# Altium schematic sheet FIT_FPGA_A-B-C.SchDoc
size A4; SheetNumber: 25; SheetTotal: 29
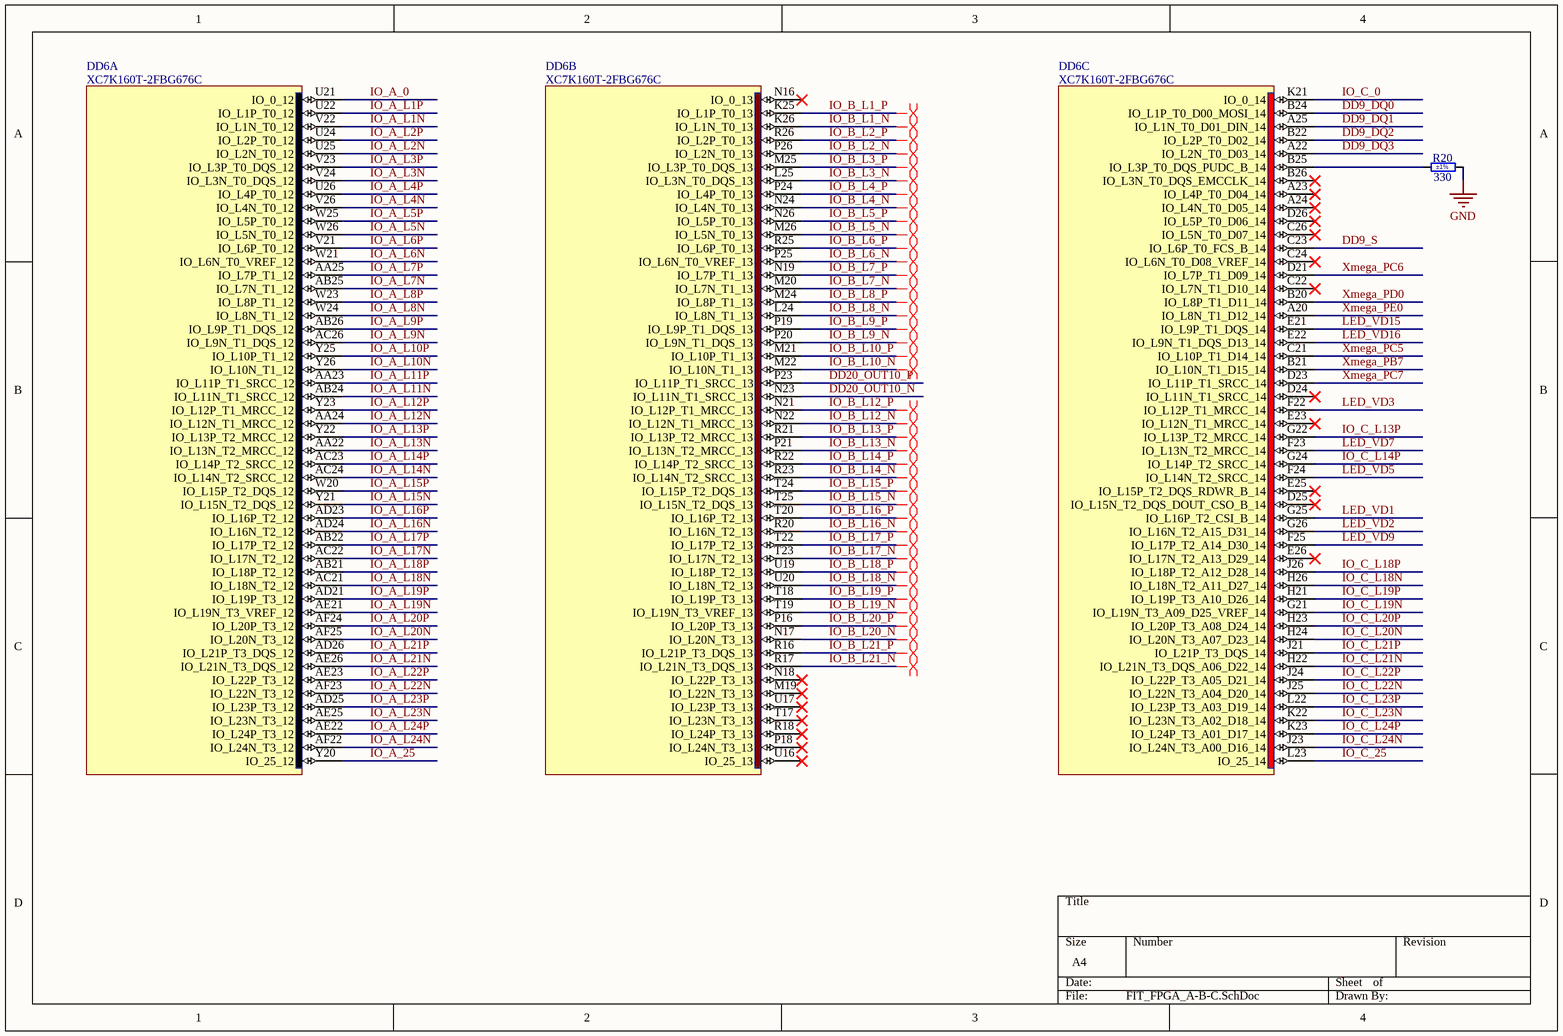
[diagram p0: FIT_FPGA_A-B-C.SchDoc]

## Parts
DD6  XC7K160T-2FBG676C  [BGA676C100P26X26_2700X2700X254]  (parts A,B,C of 15)
R20  330  Tolerance: ±1%  [RESC2012X60N]

## Nets
GND: R20.2
DD9_DQ0: DD6.B24(IO_L1P_T0_D00_MOSI_14)
DD9_DQ1: DD6.A25(IO_L1N_T0_D01_DIN_14)
DD9_DQ2: DD6.B22(IO_L2P_T0_D02_14)
DD9_DQ3: DD6.A22(IO_L2N_T0_D03_14)
DD9_S: DD6.C23(IO_L6P_T0_FCS_B_14)
DD20_OUT10_N: DD6.N23(IO_L11N_T1_SRCC_13)
DD20_OUT10_P: DD6.P23(IO_L11P_T1_SRCC_13)
IO_A_0: DD6.U21(IO_0_12)
IO_A_25: DD6.Y20(IO_25_12)
IO_A_L1N: DD6.V22(IO_L1N_T0_12)
IO_A_L1P: DD6.U22(IO_L1P_T0_12)
IO_A_L2N: DD6.U25(IO_L2N_T0_12)
IO_A_L2P: DD6.U24(IO_L2P_T0_12)
IO_A_L3N: DD6.V24(IO_L3N_T0_DQS_12)
IO_A_L3P: DD6.V23(IO_L3P_T0_DQS_12)
IO_A_L4N: DD6.V26(IO_L4N_T0_12)
IO_A_L4P: DD6.U26(IO_L4P_T0_12)
IO_A_L5N: DD6.W26(IO_L5N_T0_12)
IO_A_L5P: DD6.W25(IO_L5P_T0_12)
IO_A_L6N: DD6.W21(IO_L6N_T0_VREF_12)
IO_A_L6P: DD6.V21(IO_L6P_T0_12)
IO_A_L7N: DD6.AB25(IO_L7N_T1_12)
IO_A_L7P: DD6.AA25(IO_L7P_T1_12)
IO_A_L8N: DD6.W24(IO_L8N_T1_12)
IO_A_L8P: DD6.W23(IO_L8P_T1_12)
IO_A_L9N: DD6.AC26(IO_L9N_T1_DQS_12)
IO_A_L9P: DD6.AB26(IO_L9P_T1_DQS_12)
IO_A_L10N: DD6.Y26(IO_L10N_T1_12)
IO_A_L10P: DD6.Y25(IO_L10P_T1_12)
IO_A_L11N: DD6.AB24(IO_L11N_T1_SRCC_12)
IO_A_L11P: DD6.AA23(IO_L11P_T1_SRCC_12)
IO_A_L12N: DD6.AA24(IO_L12N_T1_MRCC_12)
IO_A_L12P: DD6.Y23(IO_L12P_T1_MRCC_12)
IO_A_L13N: DD6.AA22(IO_L13N_T2_MRCC_12)
IO_A_L13P: DD6.Y22(IO_L13P_T2_MRCC_12)
IO_A_L14N: DD6.AC24(IO_L14N_T2_SRCC_12)
IO_A_L14P: DD6.AC23(IO_L14P_T2_SRCC_12)
IO_A_L15N: DD6.Y21(IO_L15N_T2_DQS_12)
IO_A_L15P: DD6.W20(IO_L15P_T2_DQS_12)
IO_A_L16N: DD6.AD24(IO_L16N_T2_12)
IO_A_L16P: DD6.AD23(IO_L16P_T2_12)
IO_A_L17N: DD6.AC22(IO_L17N_T2_12)
IO_A_L17P: DD6.AB22(IO_L17P_T2_12)
IO_A_L18N: DD6.AC21(IO_L18N_T2_12)
IO_A_L18P: DD6.AB21(IO_L18P_T2_12)
IO_A_L19N: DD6.AE21(IO_L19N_T3_VREF_12)
IO_A_L19P: DD6.AD21(IO_L19P_T3_12)
IO_A_L20N: DD6.AF25(IO_L20N_T3_12)
IO_A_L20P: DD6.AF24(IO_L20P_T3_12)
IO_A_L21N: DD6.AE26(IO_L21N_T3_DQS_12)
IO_A_L21P: DD6.AD26(IO_L21P_T3_DQS_12)
IO_A_L22N: DD6.AF23(IO_L22N_T3_12)
IO_A_L22P: DD6.AE23(IO_L22P_T3_12)
IO_A_L23N: DD6.AE25(IO_L23N_T3_12)
IO_A_L23P: DD6.AD25(IO_L23P_T3_12)
IO_A_L24N: DD6.AF22(IO_L24N_T3_12)
IO_A_L24P: DD6.AE22(IO_L24P_T3_12)
IO_B_L1_N: DD6.K26(IO_L1N_T0_13)
IO_B_L1_P: DD6.K25(IO_L1P_T0_13)
IO_B_L2_N: DD6.P26(IO_L2N_T0_13)
IO_B_L2_P: DD6.R26(IO_L2P_T0_13)
IO_B_L3_N: DD6.L25(IO_L3N_T0_DQS_13)
IO_B_L3_P: DD6.M25(IO_L3P_T0_DQS_13)
IO_B_L4_N: DD6.N24(IO_L4N_T0_13)
IO_B_L4_P: DD6.P24(IO_L4P_T0_13)
IO_B_L5_N: DD6.M26(IO_L5N_T0_13)
IO_B_L5_P: DD6.N26(IO_L5P_T0_13)
IO_B_L6_N: DD6.P25(IO_L6N_T0_VREF_13)
IO_B_L6_P: DD6.R25(IO_L6P_T0_13)
IO_B_L7_N: DD6.M20(IO_L7N_T1_13)
IO_B_L7_P: DD6.N19(IO_L7P_T1_13)
IO_B_L8_N: DD6.L24(IO_L8N_T1_13)
IO_B_L8_P: DD6.M24(IO_L8P_T1_13)
IO_B_L9_N: DD6.P20(IO_L9N_T1_DQS_13)
IO_B_L9_P: DD6.P19(IO_L9P_T1_DQS_13)
IO_B_L10_N: DD6.M22(IO_L10N_T1_13)
IO_B_L10_P: DD6.M21(IO_L10P_T1_13)
IO_B_L12_N: DD6.N22(IO_L12N_T1_MRCC_13)
IO_B_L12_P: DD6.N21(IO_L12P_T1_MRCC_13)
IO_B_L13_N: DD6.P21(IO_L13N_T2_MRCC_13)
IO_B_L13_P: DD6.R21(IO_L13P_T2_MRCC_13)
IO_B_L14_N: DD6.R23(IO_L14N_T2_SRCC_13)
IO_B_L14_P: DD6.R22(IO_L14P_T2_SRCC_13)
IO_B_L15_N: DD6.T25(IO_L15N_T2_DQS_13)
IO_B_L15_P: DD6.T24(IO_L15P_T2_DQS_13)
IO_B_L16_N: DD6.R20(IO_L16N_T2_13)
IO_B_L16_P: DD6.T20(IO_L16P_T2_13)
IO_B_L17_N: DD6.T23(IO_L17N_T2_13)
IO_B_L17_P: DD6.T22(IO_L17P_T2_13)
IO_B_L18_N: DD6.U20(IO_L18N_T2_13)
IO_B_L18_P: DD6.U19(IO_L18P_T2_13)
IO_B_L19_N: DD6.T19(IO_L19N_T3_VREF_13)
IO_B_L19_P: DD6.T18(IO_L19P_T3_13)
IO_B_L20_N: DD6.N17(IO_L20N_T3_13)
IO_B_L20_P: DD6.P16(IO_L20P_T3_13)
IO_B_L21_N: DD6.R17(IO_L21N_T3_DQS_13)
IO_B_L21_P: DD6.R16(IO_L21P_T3_DQS_13)
IO_C_0: DD6.K21(IO_0_14)
IO_C_25: DD6.L23(IO_25_14)
IO_C_L13P: DD6.G22(IO_L13P_T2_MRCC_14)
IO_C_L14P: DD6.G24(IO_L14P_T2_SRCC_14)
IO_C_L18N: DD6.H26(IO_L18N_T2_A11_D27_14)
IO_C_L18P: DD6.J26(IO_L18P_T2_A12_D28_14)
IO_C_L19N: DD6.G21(IO_L19N_T3_A09_D25_VREF_14)
IO_C_L19P: DD6.H21(IO_L19P_T3_A10_D26_14)
IO_C_L20N: DD6.H24(IO_L20N_T3_A07_D23_14)
IO_C_L20P: DD6.H23(IO_L20P_T3_A08_D24_14)
IO_C_L21N: DD6.H22(IO_L21N_T3_DQS_A06_D22_14)
IO_C_L21P: DD6.J21(IO_L21P_T3_DQS_14)
IO_C_L22N: DD6.J25(IO_L22N_T3_A04_D20_14)
IO_C_L22P: DD6.J24(IO_L22P_T3_A05_D21_14)
IO_C_L23N: DD6.K22(IO_L23N_T3_A02_D18_14)
IO_C_L23P: DD6.L22(IO_L23P_T3_A03_D19_14)
IO_C_L24N: DD6.J23(IO_L24N_T3_A00_D16_14)
IO_C_L24P: DD6.K23(IO_L24P_T3_A01_D17_14)
LED_VD1: DD6.G25(IO_L16P_T2_CSI_B_14)
LED_VD2: DD6.G26(IO_L16N_T2_A15_D31_14)
LED_VD3: DD6.F22(IO_L12P_T1_MRCC_14)
LED_VD5: DD6.F24(IO_L14N_T2_SRCC_14)
LED_VD7: DD6.F23(IO_L13N_T2_MRCC_14)
LED_VD9: DD6.F25(IO_L17P_T2_A14_D30_14)
LED_VD15: DD6.E21(IO_L9P_T1_DQS_14)
LED_VD16: DD6.E22(IO_L9N_T1_DQS_D13_14)
Xmega_PB7: DD6.B21(IO_L10N_T1_D15_14)
Xmega_PC5: DD6.C21(IO_L10P_T1_D14_14)
Xmega_PC6: DD6.D21(IO_L7P_T1_D09_14)
Xmega_PC7: DD6.D23(IO_L11P_T1_SRCC_14)
Xmega_PD0: DD6.B20(IO_L8P_T1_D11_14)
Xmega_PE0: DD6.A20(IO_L8N_T1_D12_14)
NetDD6_B25: DD6.B25(IO_L3P_T0_DQS_PUDC_B_14) R20.1

Not connected (* = marked no-connect by the designer): DD6 A23(IO_L4P_T0_D04_14)* A24(IO_L4N_T0_D05_14)* B26(IO_L3N_T0_DQS_EMCCLK_14)* C22(IO_L7N_T1_D10_14)* C24(IO_L6N_T0_D08_VREF_14)* C26(IO_L5N_T0_D07_14)* D24(IO_L11N_T1_SRCC_14)* D25(IO_L15N_T2_DQS_DOUT_CSO_B_14)* D26(IO_L5P_T0_D06_14)* E23(IO_L12N_T1_MRCC_14)* E25(IO_L15P_T2_DQS_RDWR_B_14)* E26(IO_L17N_T2_A13_D29_14)* M19(IO_L22N_T3_13)* N16(IO_0_13)* N18(IO_L22P_T3_13)* P18(IO_L24N_T3_13)* R18(IO_L24P_T3_13)* T17(IO_L23N_T3_13)* U16(IO_25_13)* U17(IO_L23P_T3_13)*

## Layout directives
differential pair: IO_B_L1_N, IO_B_L1_P, IO_B_L2_N, IO_B_L2_P, IO_B_L3_N, IO_B_L3_P, IO_B_L4_N, IO_B_L4_P, IO_B_L5_N, IO_B_L5_P, IO_B_L6_N, IO_B_L6_P, IO_B_L7_N, IO_B_L7_P, IO_B_L8_N, IO_B_L8_P, IO_B_L9_N, IO_B_L9_P, IO_B_L10_N, IO_B_L10_P, IO_B_L12_N, IO_B_L12_P, IO_B_L13_N, IO_B_L13_P, IO_B_L14_N, IO_B_L14_P, IO_B_L15_N, IO_B_L15_P, IO_B_L16_N, IO_B_L16_P, IO_B_L17_N, IO_B_L17_P, IO_B_L18_N, IO_B_L18_P, IO_B_L19_N, IO_B_L19_P, IO_B_L20_N, IO_B_L20_P, IO_B_L21_N, IO_B_L21_P

## Library data of the parts
DD6 = XC7K160T-2FBG676C: KINTEX-7, FPGA, 676-Ball BGA, Pb-Free; Part Description: KINTEX-7 FPGA, 162240 Logic Cells, 400 User I/O, 8 GTXs, 676-Ball BGA, Speed Grade 2, Commercial Grade, Pb-Free; Manufacturer: XILINX; PressFit: No; Bonding: No; Part Number: XC7K160T-2FBG676C; Component Kind: Standard; Component Type: Standard; Device: XC7K160T-2FBG676C; PackageDescription: BGA, 1.00mm Pitch, Square; 676 Pin, 26 Columns X 26 Rows, Body 27.0mm X 27.0mm X 2.54mm H, IPC Medium Density; Manufacturer Part Number: XC7K160T-2FBG676C; Pin Count: 676; Case: BGA676; Mounted: Yes; Socket: No; SMD: Yes; Sense: No; ComponentHeight: 2.54mm; HelpURL: \\cern.ch\dfs\Applications\Altium\Datasheets\XC7K160T-xFBG676C.pdf; ComponentLink1URL: \\cern.ch\dfs\Applications\Altium\Datasheets\XC7K160T-xFBG676C_Package-Pinout.pdf; ComponentLink1Description: Package/Pinout; Author: CERN DEM BC; CreateDate: 06.02.2020; LatestRevisionDate: 06.02.2020
R20 = R0805_330R_1%_0.125W_100PPM: Resistor - 1%; Part Description: General Purpose Thick Film Chip Resistor; Manufacturer: GENERIC; Manufacturer1 Part Number: NRC10F3300TRF; Power: 0.125W; TC: ±100ppm/°C; PressFit: No; Part Number: R0805_330R_1%_0.125W_100PPM; Component Kind: Standard; Component Type: Standard; Pin Count: 2; Value: 330; Status: Preferred; Manufacturer Part Number: R0805_330R_1%_0.125W_100PPM; Case: 0805; Mounted: Yes; Sense: No; Socket: No; SMD: Yes; Manufacturer1 Example: NIC COMPONENT; Manufacturer1 ComponentHeight: 0.6mm; HelpURL: \\cern.ch\dfs\Applications\Altium\Datasheets\R0805_NIC_NRC.pdf; Author: CERN DEM JLC; CreateDate: 03.12.2007; LatestRevisionDate: 13.03.2008